# EAGLE schematic Domino Qi (EAGLE 6.5.0)
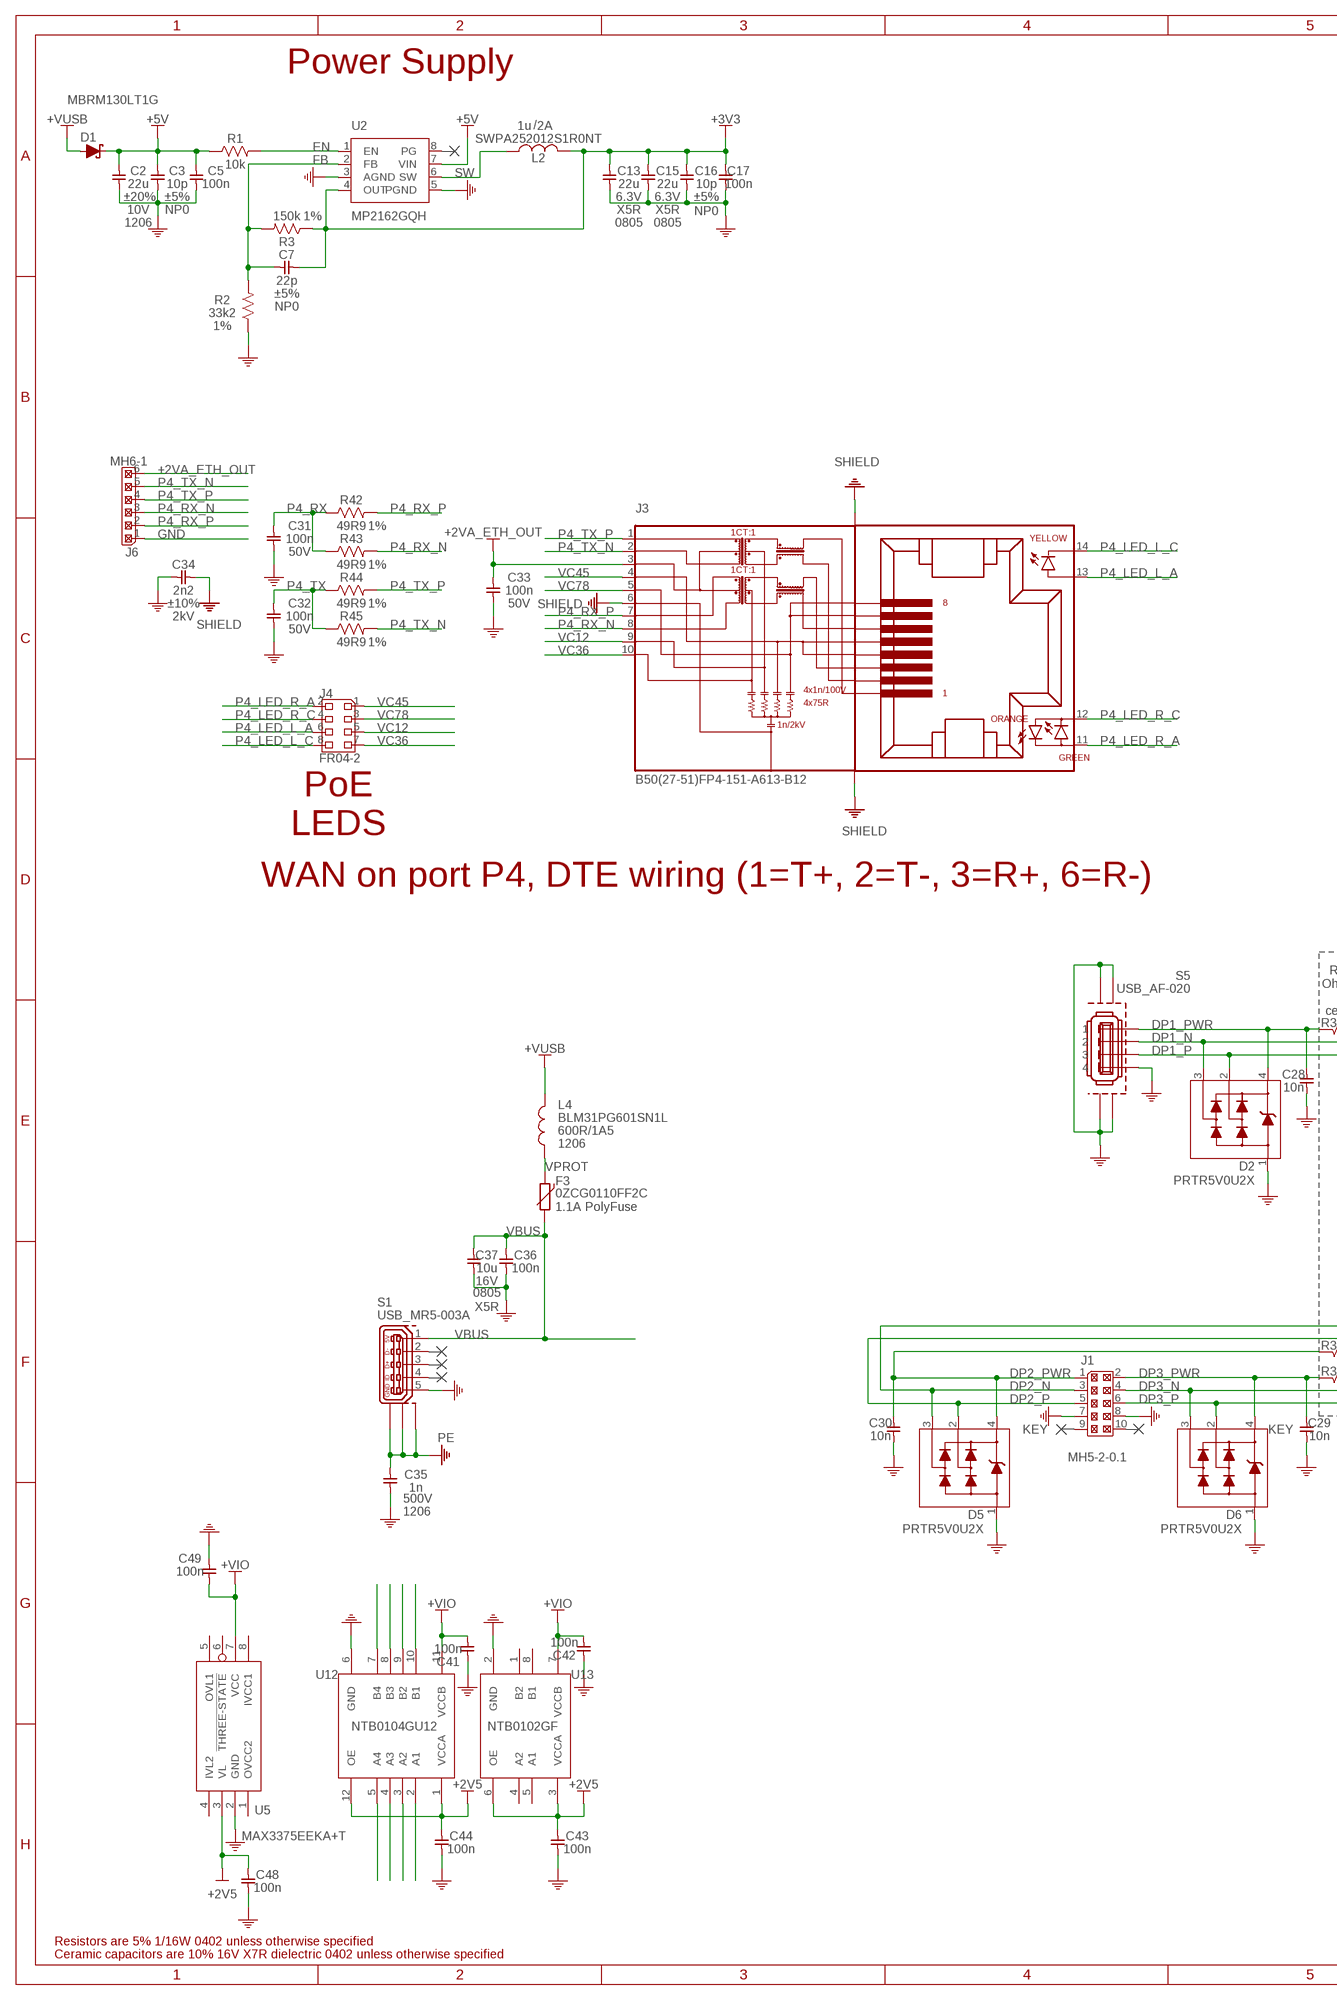
[diagram p0: schematic, sheet 1, part 1 of 2]
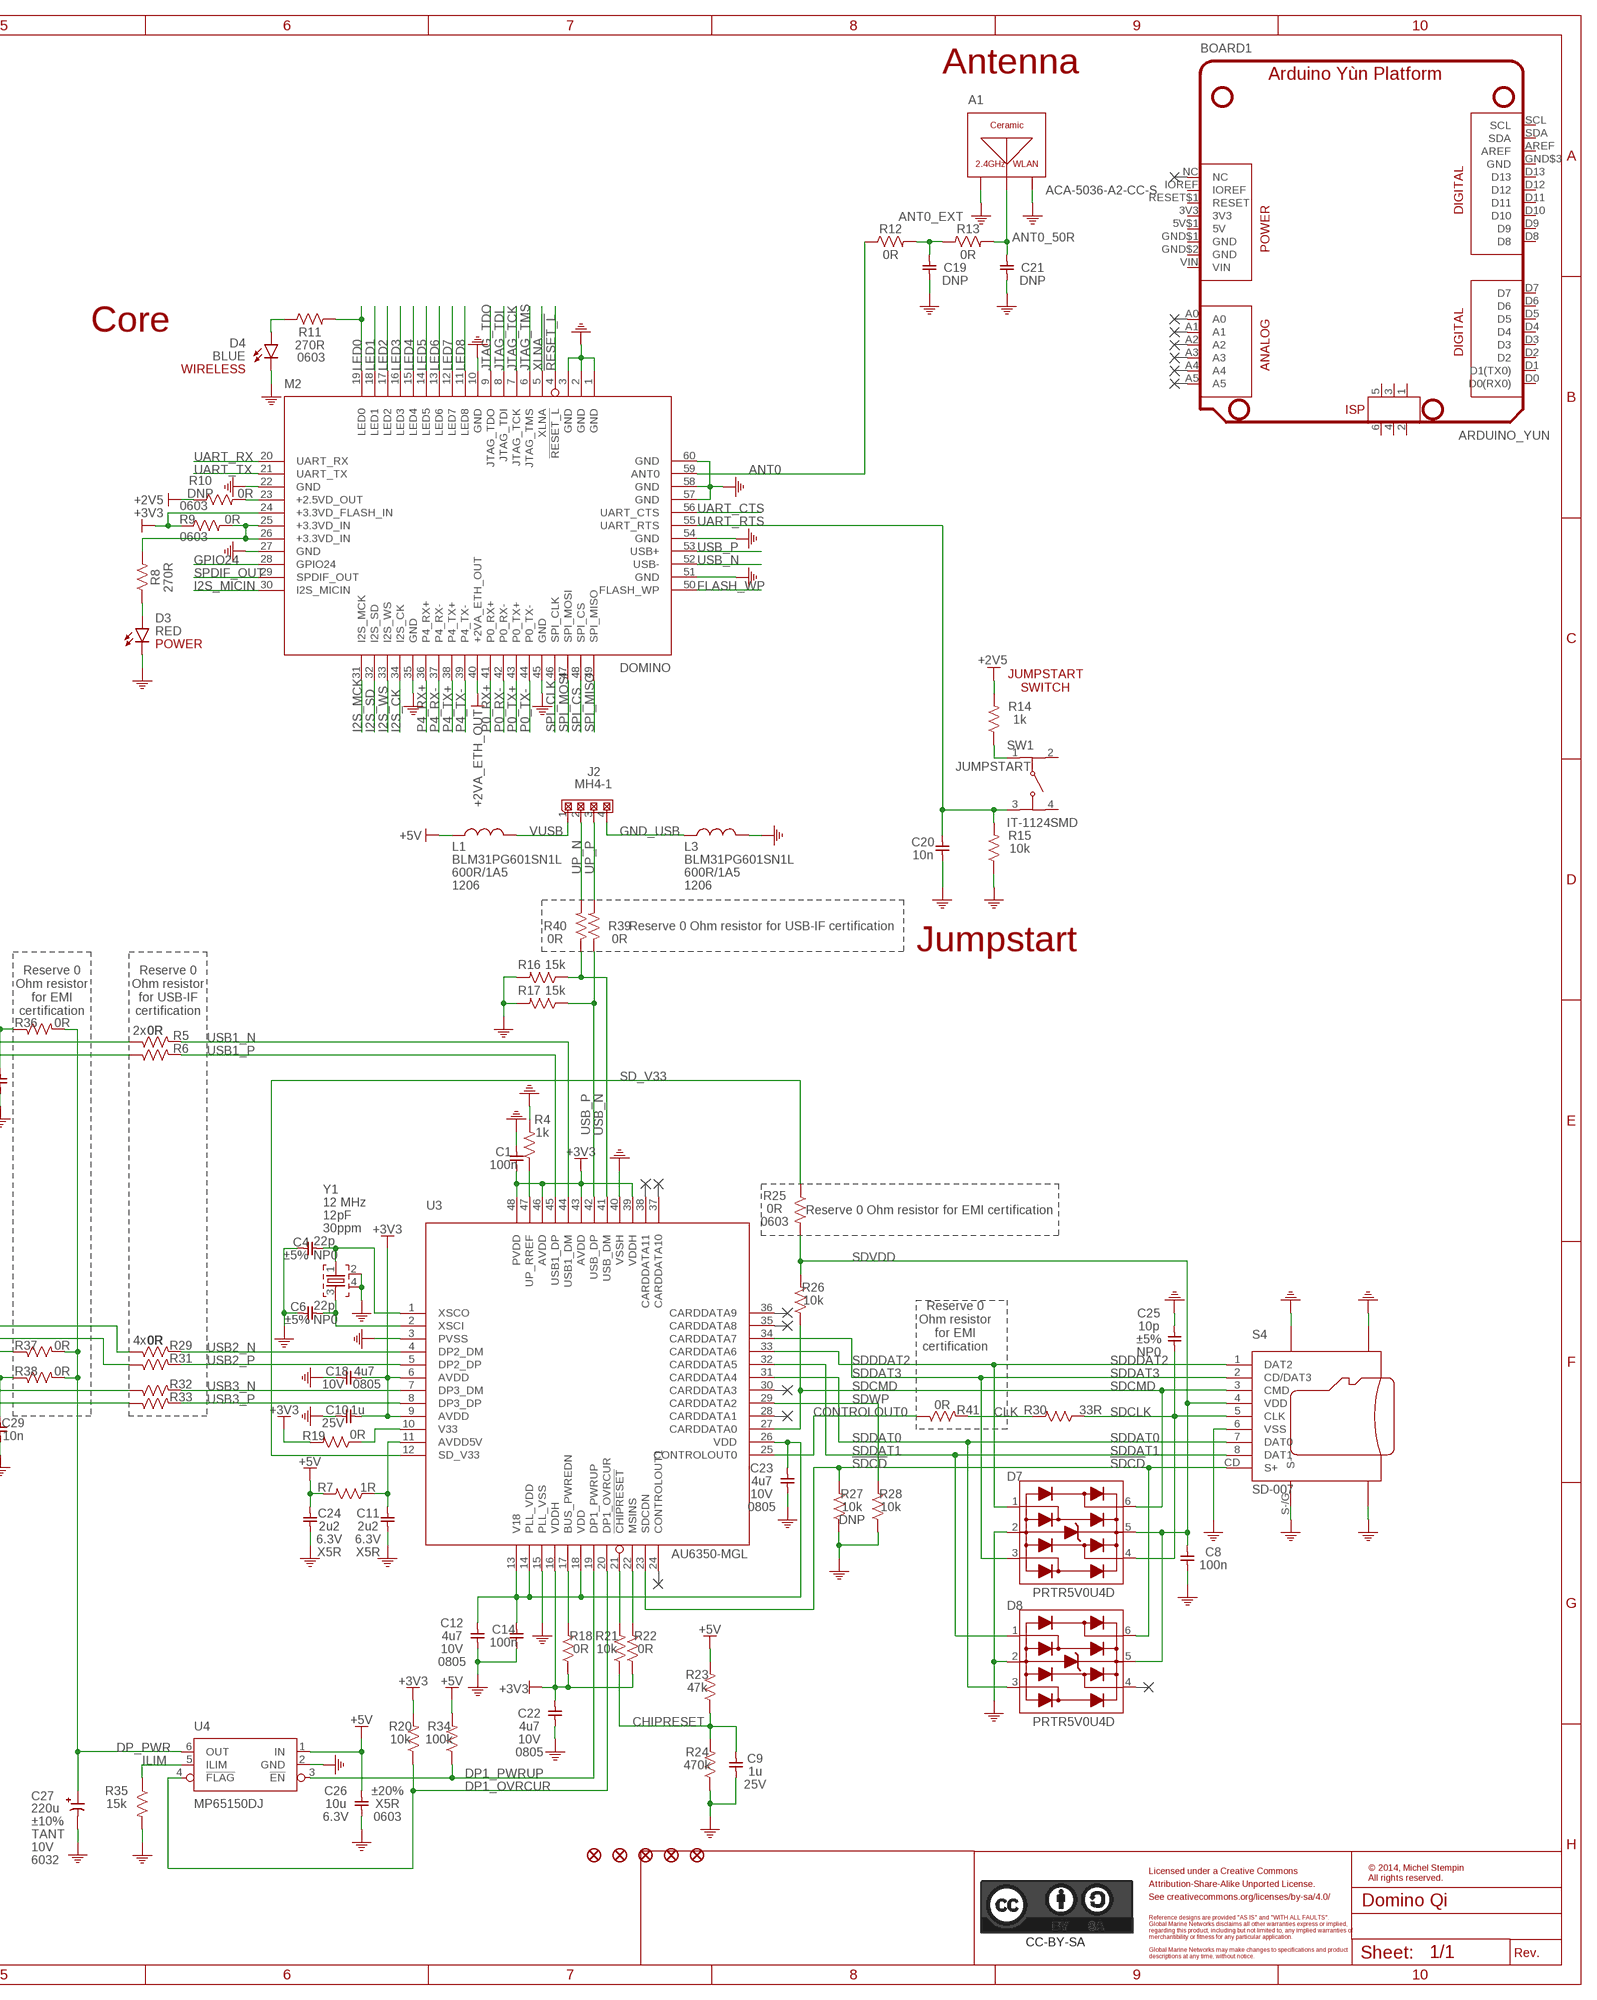
[diagram p1: schematic, sheet 1, part 2 of 2]
PORT1 (NC): BOM: EXCLUDE
PORT2 (NC): BOM: EXCLUDE
PORT3 (NC): BOM: EXCLUDE
PORT4 (NC): BOM: EXCLUDE
PORT5 (NC): BOM: EXCLUDE
PORT6 (NC): BOM: EXCLUDE
PORT7 (NC): BOM: EXCLUDE
PORT8 (NC): BOM: EXCLUDE
PORT9 (NC): BOM: EXCLUDE
PORT10 (NC): BOM: EXCLUDE
PORT11 (NC): BOM: EXCLUDE
PORT12 (NC): BOM: EXCLUDE
PORT13 (NC): BOM: EXCLUDE
PORT14 (NC): BOM: EXCLUDE
PORT15 (NC): BOM: EXCLUDE
PORT16 (NC): BOM: EXCLUDE
PORT17 (NC): BOM: EXCLUDE
PORT18 (NC): BOM: EXCLUDE
PORT19 (NC): BOM: EXCLUDE
PORT20 (NC): BOM: EXCLUDE
PORT21 (NC): BOM: EXCLUDE

## Parts
A1  ACA-5036-A2-CC-S  [ACA-5036-A2-CC-S]
BOARD1  ARDUINO_YUN  [ARDUINO-YUN-PLATFORM]
C1  100n  CAP_0402  [C0402]
C2  22u  CAP_1206  [C1206]
C3  10p  CAP_0402  [C0402]
C4  22p  CAP_0402  [C0402]
C5  100n  CAP_0402  [C0402]
C6  22p  CAP_0402  [C0402]
C7  22p  CAP_0402  [C0402]
C8  100n  CAP_0402  [C0402]
C9  1u  CAP_0402  [C0402]
C10  1u  CAP_0402  [C0402]
C11  2u2  CAP_0402  [C0402]
C12  4u7  CAP_0805  [C0805]
C13  22u  CAP_0805  [C0805]
C14  100n  CAP_0402  [C0402]
C15  22u  CAP_0805  [C0805]
C16  10p  CAP_0402  [C0402]
C17  100n  CAP_0402  [C0402]
C18  4u7  CAP_0805  [C0805]
C19  DNP  CAP_0402  [C0402]
C20  10n  CAP_0402  [C0402]
C21  DNP  CAP_0402  [C0402]
C22  4u7  CAP_0805  [C0805]
C23  4u7  CAP_0805  [C0805]
C24  2u2  CAP_0402  [C0402]
C25  10p  CAP_0402  [C0402]
C26  10u  CAP_0603  [C0603]
C27  220u  CPOL_C/6032-25  [C/6032-25]
C28  10n  CAP_0402  [C0402]
C29  10n  CAP_0402  [C0402]
C30  10n  CAP_0402  [C0402]
C31  100n  CAP_0402  [C0402]
C32  100n  CAP_0402  [C0402]
C33  100n  CAP_0402  [C0402]
C34  2n2  CAP_1206  [C1206]
C35  1n  CAP_1206  [C1206]
C36  100n  CAP_0402  [C0402]
C37  10u  CAP_0805  [C0805]
C41  100n  CAP_0402  [C0402]
C42  100n  CAP_0402  [C0402]
C43  100n  CAP_0402  [C0402]
C44  100n  CAP_0402  [C0402]
C48  100n  CAP_0402  [C0402]
C49  100n  CAP_0402  [C0402]
D1  MBRM130LT1G  [DO-216AA]
D2  PRTR5V0U2X  [SOT143B]
D3  RED  LED_0603  [LED0603]
D4  BLUE  LED_0603  [LED0603]
D5  PRTR5V0U2X  [SOT143B]
D6  PRTR5V0U2X  [SOT143B]
D7  PRTR5V0U4D  [SOT23-6]
D8  PRTR5V0U4D  [SOT23-6]
F1  FIDUCIAL  [FIDUCIAL]
F2  FIDUCIAL  [FIDUCIAL]
F3  0ZCG0110FF2C  [PTC1812]
F4  FIDUCIAL  [FIDUCIAL]
F5  FIDUCIAL  [FIDUCIAL]
F6  FIDUCIAL  [FIDUCIAL]
J1  MH5-2-0.1  MH5-2  [MH05-2-0.1]
J2  MH4-1  [MH4-1-0.1]
J3  B50(27-51)FP4-151-A613-B12  [B50(27-51)FP4-151-A613-B12]
J4  FR04-2  [FR04-2-0.1]
J6  MH6-1  [MH6-1-0.1]
L1  BLM31PG601SN1L  FB_1206  [FB1206]
L2  SWPA252012S1R0NT  [SWPA252012S]
L3  BLM31PG601SN1L  FB_1206  [FB1206]
L4  BLM31PG601SN1L  FB_1206  [FB1206]
M2  DOMINO  [DOMINO]
R1  10k  RES_0402  [R0402]
R2  33k2  RES_0402  [R0402]
R3  150k  RES_0402  [R0402]
R4  1k  RES_0402  [R0402]
R5  0R  RES_0402  [R0402]
R6  0R  RES_0402  [R0402]
R7  1R  RES_0402  [R0402]
R8  270R  RES_0402  [R0402]
R9  0R  RES_0603  [R0603]
R10  0R  RES_0603  [R0603]
R11  270R  RES_0603  [R0603]
R12  0R  RES_0402  [R0402]
R13  0R  RES_0402  [R0402]
R14  1k  RES_0402  [R0402]
R15  10k  RES_0402  [R0402]
R16  15k  RES_0402  [R0402]
R17  15k  RES_0402  [R0402]
R18  0R  RES_0402  [R0402]
R19  0R  RES_0402  [R0402]
R20  10k  RES_0402  [R0402]
R21  10k  RES_0402  [R0402]
R22  0R  RES_0402  [R0402]
R23  47k  RES_0402  [R0402]
R24  470k  RES_0402  [R0402]
R25  0R  RES_0603  [R0603]
R26  10k  RES_0402  [R0402]
R27  10k  RES_0402  [R0402]
R28  10k  RES_0402  [R0402]
R29  0R  RES_0402  [R0402]
R30  33R  RES_0402  [R0402]
R31  0R  RES_0402  [R0402]
R32  0R  RES_0402  [R0402]
R33  0R  RES_0402  [R0402]
R34  100k  RES_0402  [R0402]
R35  15k  RES_0402  [R0402]
R36  0R  RES_0402  [R0402]
R37  0R  RES_0402  [R0402]
R38  0R  RES_0402  [R0402]
R39  0R  RES_0402  [R0402]
R40  0R  RES_0402  [R0402]
R41  0R  RES_0402  [R0402]
R42  49R9  RES_0402  [R0402]
R43  49R9  RES_0402  [R0402]
R44  49R9  RES_0402  [R0402]
R45  49R9  RES_0402  [R0402]
S1  USB_MR5-003A  [USB_MR5-003A]
S4  SD-007  MICRO-SD  [SD-007]
S5  USB_AF-020  [USB_AF-020]
SW1  IT-1124SMD  [IT-1124SMD]
U2  MP2162GQH  [QFN-8_2X1.5]
U3  AU6350-MGL  [LQFP-48_7X7]
U4  MP65150DJ  [SOT23-6]
U5  MAX3375EEKA+T  [SOT23-8]
U12  NTB0104GU12  [XQFN-12]
U13  NTB0102GF  [SOT1089]
U$2  CC-BY-SA_LOGO  [CC-BY-SA_LOGO]
Y1  12 MHz  CRYSTAL_2SH  [CRYSTAL_32X25]

## Nets
!CHIPRESET: R21.2 U3.21(!CHIPRESET)
!RESET_L: M2.4(!RESET_L)
!SDCD: D8.6(I/O4) R27.2 S4.CD(S+) U3.23(SDCDN)
+2.5VD_OUT: M2.23(+2.5VD_OUT) R10.2
+2V5: C43.2 C44.2 C48.2 R10.1 R14.2 U5.3(VL) U12.1(VCCA) U12.12(OE) U13.3(VCCA) U13.6(OE)
+2VA_ETH_OUT [Ethernet0]: C33.2 J3.3 J6.6 M2.40(+2VA_ETH_OUT)
+3.3VD_IN1: M2.25(+3.3VD_IN) M2.26(+3.3VD_IN) R8.2 R9.2
+3V3: C1.2 C7.2 C10.2 C13.1 C15.1 C16.1 C17.1 C18.2 C22.2 L2.2 M2.24(+3.3VD_FLASH_IN) R3.1 R9.1 R18.1 R19.2 R20.2 R22.1 U2.4(OUT) U3.6(AVDD) U3.9(AVDD) U3.16(VDDH) U3.39(VDDH) U3.43(AVDD) U3.46(AVDD) U3.48(PVDD)
+5V: C2.1 C3.1 C5.1 C24.1 C26.1 D1.1(C) L1.2 R1.1 R7.2 R23.2 R34.2 U2.7(VIN) U4.1(IN)
+VIO: C41.1 C42.1 C49.1 U5.7(VCC) U12.11(VCCB) U13.7(VCCB)
+VUSB: D1.2(A) L4.1
ANT0 [RF]: M2.59(ANT0) R12.1
ANT0_50R: A1.FEED(A) C21.1 R13.2
ANT0_EXT [RF]: C19.1 R12.2 R13.1
AVDD5V1: C11.1 R7.1 U3.11(AVDD5V)
BLUE_LED: D4.2(A) R11.1
BUS_PWREDN: R18.2 U3.17(BUS_PWREDN)
CHIPRESET: C9.1 R21.1 R23.1 R24.2
CLK: R30.2 R41.2
CONTROLOUT0: R41.1 U3.25(CONTROLOUT0)
DP1_N [USB]: D2.3 R5.1 S5.2
DP1_OVRCUR: R20.1 U3.20(DP1_OVRCUR) U4.4(!FLAG)
DP1_P [USB]: D2.2 R6.1 S5.3
DP1_PWR: C28.1 D2.4 R36.1 S5.1
DP1_PWRUP: R34.1 U3.19(DP1_PWRUP) U4.3(!EN)
DP2_N [USB]: D5.3 J1.3 R29.1
DP2_P [USB]: D5.2 J1.5 R31.1
DP2_PWR: C30.1 D5.4 J1.1 R37.1
DP3_N [USB]: D6.3 J1.4 R32.1
DP3_P [USB]: D6.2 J1.6 R33.1
DP3_PWR: C29.1 D6.4 J1.2 R38.1
DP_PWR: C27.1(+) R36.2 R37.2 R38.2 U4.6(OUT)
EN: R1.2 U2.1(EN)
FB: C7.1 R2.2 R3.2 U2.2(FB)
FLASH_WP: M2.50(FLASH_WP)
GND: A1.GND$1(GND) A1.GND$2(GND) C1.1 C2.2 C3.2 C4.1 C5.2 C6.1 C8.2 C9.2 C10.1 C11.2 C12.1 C13.2 C14.2 C15.2 C16.2 C17.2 C18.1 C19.2 C20.2 C21.2 C22.1 C23.1 C24.2 C25.2 C26.2 C27.2(-) C28.2 C29.2 C30.2 C31.1 C32.1 C33.1 C34.1 C35.2 C36.2 C37.2 C41.2 C42.2 C43.1 C44.1 C48.1 C49.2 D2.1 D3.1(C) D4.1(C) D5.1 D6.1 D7.2(GND) D8.2(GND) J1.7 J1.8 J6.1 L3.1 M2.1(GND) M2.2(GND) M2.3(GND) M2.10(GND) M2.22(GND) M2.27(GND) M2.35(GND) M2.45(GND) M2.51(GND) M2.54(GND) M2.57(GND) M2.58(GND) M2.60(GND) R2.1 R4.2 R15.1 R16.2 R17.2 R24.1 R27.1 R28.1 R35.2 S1.5 S4.6(VSS) S4.G$1(G) S4.G$2(G) S4.G$3(G) S4.S-/G(S-) S5.4 S5.G$1(G) S5.G$2(G) S5.G$3(G) S5.G$4(G) U2.3(AGND) U2.5(PGND) U3.3(PVSS) U3.15(PLL_VSS) U3.40(VSSH) U4.2(GND) U5.2(GND) U12.6(GND) U13.2(GND) Y1.2 Y1.4
GND_USB: J2.4 L3.2
GPIO24: M2.28(GPIO24)
I2S_CK: M2.34(I2S_CK)
I2S_MCK: M2.31(I2S_MCK)
I2S_MICIN: M2.30(I2S_MICIN)
I2S_SD: M2.32(I2S_SD)
I2S_WS: M2.33(I2S_WS)
ILIM: R35.1 U4.5(ILIM)
JTAG_TCK: M2.7(JTAG_TCK)
JTAG_TDI: M2.8(JTAG_TDI)
JTAG_TDO: M2.9(JTAG_TDO)
JTAG_TMS: M2.6(JTAG_TMS)
JUMPSTART: R14.1 SW1.1
LED0: M2.19(LED0) R11.2
LED1: M2.18(LED1)
LED2: M2.17(LED2)
LED3: M2.16(LED3)
LED4: M2.15(LED4)
LED5: M2.14(LED5)
LED6: M2.13(LED6)
LED7: M2.12(LED7)
LED8: M2.11(LED8)
MSINS: R22.2 U3.22(MSINS)
N$1: D3.2(A) R8.1
N$2: U12.5(A4)
N$3: U12.4(A3)
N$4: U12.3(A2)
N$5: U12.2(A1)
N$6: U12.10(B1)
N$7: U12.9(B2)
N$8: U12.8(B3)
N$9: U12.7(B4)
P0_RX+ [Ethernet0]: M2.41(P0_RX+)
P0_RX- [Ethernet0]: M2.42(P0_RX-)
P0_TX+ [Ethernet0]: M2.43(P0_TX+)
P0_TX- [Ethernet0]: M2.44(P0_TX-)
P4_LED_L_A: J3.13 J4.6
P4_LED_L_C: J3.14 J4.8
P4_LED_R_A: J3.11 J4.2
P4_LED_R_C: J3.12 J4.4
P4_RX: C31.2 R42.1 R43.1
P4_RX+ [Ethernet0]: M2.36(P4_RX+)
P4_RX- [Ethernet0]: M2.37(P4_RX-)
P4_RX_N [USB]: J3.8 J6.3 R43.2
P4_RX_P [USB]: J3.7 J6.2 R42.2
P4_TX: C32.2 R44.1 R45.1
P4_TX+ [Ethernet0]: M2.38(P4_TX+)
P4_TX- [Ethernet0]: M2.39(P4_TX-)
P4_TX_N [USB]: J3.2 J6.5 R45.2
P4_TX_P [USB]: J3.1 J6.4 R44.2
PE: C35.1 S1.S$1(M0) S1.S$2(M1) S1.S$3(M2)
SD_V33: R25.1 U3.12(SD_V33)
SDCLK: C25.1 D7.4(I/O3) R30.1 S4.5(CLK)
SDCMD: D7.6(I/O4) R26.1 S4.3(CMD) U3.27(CARDDATA0)
SDDAT0: D8.3(I/O2) S4.7(DAT0) U3.31(CARDDATA4)
SDDAT1: D8.1(I/O1) S4.8(DAT1) U3.32(CARDDATA5)
SDDAT3: D7.3(I/O2) S4.2(CD/DAT3) U3.34(CARDDATA7)
SDDDAT2: D7.1(I/O1) S4.1(DAT2) U3.33(CARDDATA6)
SDVDD: C8.1 D7.5(VCC) D8.5(VCC) R25.2 R26.2 S4.4(VDD)
SDWP: R28.2 U3.29(CARDDATA2)
SHIELD: C34.2 J3.6 J3.SH$1(SHIELD) J3.SH$2(SHIELD)
SPDIF_OUT: M2.29(SPDIF_OUT)
SPI_CLK: M2.46(SPI_CLK)
SPI_CS: M2.48(SPI_CS)
SPI_MISO: M2.49(SPI_MISO)
SPI_MOSI: M2.47(SPI_MOSI)
SW: L2.1 U2.6(SW)
UART_CTS: M2.56(UART_CTS)
UART_RTS: C20.1 M2.55(UART_RTS) R15.2 SW1.3
UART_RX: M2.20(UART_RX)
UART_TX: M2.21(UART_TX)
UP_N [USB]: J2.2 R40.2
UP_P [USB]: J2.3 R39.2
UP_PREF: R4.1 U3.47(UP_RREF)
USB1_N [USB]: R5.2 U3.44(USB1_DM)
USB1_P [USB]: R6.2 U3.45(USB1_DP)
USB2_N [USB]: R29.2 U3.4(DP2_DM)
USB2_P [USB]: R31.2 U3.5(DP2_DP)
USB3_N [USB]: R32.2 U3.7(DP3_DM)
USB3_P [USB]: R33.2 U3.8(DP3_DP)
USB_N [USB]: M2.52(USB-) R16.1 R40.1 U3.41(USB_DM)
USB_P [USB]: M2.53(USB+) R17.1 R39.1 U3.42(USB_DP)
V1: R19.1 U3.10(V33)
V18: C12.2 C14.1 C23.2 U3.13(V18) U3.14(PLL_VDD) U3.18(VDD) U3.26(VDD)
VBUS: C36.1 C37.1 F3.2 S1.1
VC12 [RF]: J3.9 J4.5
VC36 [RF]: J3.10 J4.7
VC45 [RF]: J3.4 J4.1
VC78 [RF]: J3.5 J4.3
VPROT: F3.1 L4.2
VUSB: J2.1 L1.1
XLNA: M2.5(XLNA)
XSCI: C6.2 U3.2(XSCI) Y1.3
XSCO: C4.2 U3.1(XSCO) Y1.1
Unconnected: BOARD1.1(MISO) BOARD1.3(SCK) BOARD1.3V3 BOARD1.4(MOSI) BOARD1.5(RESET) BOARD1.A0 BOARD1.A1 BOARD1.A2 BOARD1.A3 BOARD1.A4 BOARD1.A5 BOARD1.AREF BOARD1.D0(D0(RX0)) BOARD1.D1(D1(TX0)) BOARD1.D2 BOARD1.D3 BOARD1.D4 BOARD1.D5 BOARD1.D6 BOARD1.D7 BOARD1.D8 BOARD1.D9 BOARD1.D10 BOARD1.D11 BOARD1.D12 BOARD1.D13 BOARD1.GND$1(GND) BOARD1.GND$2(GND) BOARD1.NC BOARD1.RESET$1(RESET) BOARD1.SCL BOARD1.SDA D8.4(I/O3) J1.9 J1.10 S1.2 S1.3 S1.4 SW1.2 SW1.4 U2.8(PG) U3.24(CONTROLOUT1) U3.28(CARDDATA1) U3.30(CARDDATA3) U3.35(CARDDATA8) U3.36(CARDDATA9) U3.37(CARDDATA10) U3.38(CARDDATA11) U5.1(OVCC2) U5.4(IVL2) U5.5(OVL1) U5.6(!THREE-STATE) U5.8(IVCC1) U13.1(B2) U13.4(A2) U13.5(A1) U13.8(B1)

## Notes on the sheet
- Power Supply | Antenna
- /
- Core
- WIRELESS
- POWER
- JUMPSTART
  SWITCH
- PoE
- LEDS
- WAN on port P4, DTE wiring (1=T+, 2=T-, 3=R+, 6=R-)
- Reserve 0 Ohm resistor for USB-IF certification
- Jumpstart
- Reserve 0
  Ohm resistor
  for EMI
  certification
- Reserve 0
  Ohm resistor
  for USB-IF
  certification
- 2x
- PolyFuse | Reserve 0 Ohm resistor for EMI certification
- Reserve 0
  Ohm resistor
  for EMI
  certification
- 4x
- KEY | KEY
- Licensed under a Creative Commons
- © 2014, Michel Stempin
  All rights reserved.
- Attribution-Share-Alike Unported License.
- See creativecommons.org/licenses/by-sa/4.0/
- Reference designs are provided "AS IS" and "WITH ALL FAULTS".
- Global Marine Networks disclaims all other warranties express or implied,
- regarding this product, including but not limited to, any implied warranties of
- merchantibility or fitness for any particular application.
- Resistors are 5% 1/16W 0402 unless otherwise specified
- Global Marine Networks may make changes to specifications and product
- Ceramic capacitors are 10% 16V X7R dielectric 0402 unless otherwise specified | descriptions at any time, without notice. | Rev.

## Power pins joined to a net without a drawn wire
5V: BOARD1.2(5V) BOARD1.5V$1(5V)
GND: BOARD1.6(GND) BOARD1.GND$3(GND)
IOREF: BOARD1.IOREF
VIN: BOARD1.VIN

## Library data of the parts
A1 = Domino:ACA-5036-A2-CC-S: 2.4GHz ISM Band Chip Antenna; PARTNO: ACA-5036-A2-CC-S
BOARD1 = Domino:ARDUINO_YUN: Arduino Yùn Platform
C1 C5 C8 C14 C17 C31-C33 C36 C41-C44 C48 C49 = Domino:CAP_: Capacitor; PARTNO: C0402_100n_X7R_10%_CER_50V; SIZE: 0402; TC: X7R; TOL: ±10%; TYPE: CER; VOLT: 50V
C2 = Domino:CAP_: Capacitor; PARTNO: C1206_22u_X7R_20%_CER_10V; SIZE: 1206; TC: X7R; TOL: ±20%; TYPE: CER; VOLT: 10V
C3 C16 C25 = Domino:CAP_: Capacitor; PARTNO: C0402_10p_NP0_5%_CER_50V; SIZE: 0402; TC: NP0; TOL: ±5%; TYPE: CER; VOLT: 50V
C4 C6 C7 = Domino:CAP_: Capacitor; PARTNO: C0402_22p_NP0_5%_CER_50V; SIZE: 0402; TC: NP0; TOL: ±5%; TYPE: CER; VOLT: 50V
C9 C10 = Domino:CAP_: Capacitor; PARTNO: C0402_1u_X7R_10%_CER_25V; SIZE: 0402; TC: X7R; TOL: ±10%; TYPE: CER; VOLT: 25V
C11 C24 = Domino:CAP_: Capacitor; PARTNO: C0402_2u2_X5R_10%_CER_6V3; SIZE: 0402; TC: X5R; TOL: ±10%; TYPE: CER; VOLT: 6.3V
C12 C18 C22 C23 = Domino:CAP_: Capacitor; PARTNO: C0805_4u7_X7R_10%_CER_6V3; SIZE: 0805; TC: X7R; TOL: 10%; TYPE: CER; VOLT: 10V
C13 C15 = Domino:CAP_: Capacitor; PARTNO: C0805_22u_X5R_20%_CER_6V3; SIZE: 0805; TC: X5R; TOL: ±20%; TYPE: CER; VOLT: 6.3V
C19 C21 = Domino:CAP_: Capacitor; DNP: T; PARTNO: C0402_DNP; SIZE: 0402
C20 C28-C30 = Domino:CAP_: Capacitor; PARTNO: C0402_10n_X7R_10%_CER_50V; SIZE: 0402; TC: X7R; TOL: ±10%; TYPE: CER; VOLT: 50V
C26 = Domino:CAP_: Capacitor; PARTNO: C0603_10u_X5R_20%_CER_6V3; SIZE: 0603; TC: X5R; TOL: ±20%; TYPE: CER; VOLT: 6.3V
C27 = Domino:CPOL_?*: Polarized Capacitor; PARTNO: CPOLC-6032_220u_20%_TANT_10V; SIZE: 6032; TOL: ±10%; TYPE: TANT; VOLT: 10V
C34 = Domino:CAP_: Capacitor; PARTNO: C1210_2n2_X7R_10%_CER_2kV; SIZE: 1206; TC: X7R; TOL: ±10%; TYPE: CER; VOLT: 2kV
C35 = Domino:CAP_: Capacitor; PARTNO: C1206_1n_X7R_10%_CER_500V; SIZE: 1206; TC: X7R; TOL: ±10%; TYPE: CER; VOLT: 500V
C37 = Domino:CAP_: Capacitor; PARTNO: C0805_10u_X5R_10%_CER_16V; SIZE: 0805; TC: X5R; TOL: ±10%; TYPE: CER; VOLT: 16V
D1 = Domino:MBRM130: Schottky Barrier Rectifier, 1A, 30V; PARTNO: MBRM130LT1G; RATE: 1A; VOLT: 30V
D2 D5 D6 = Domino:PRTR5V0U2X: Ultra low capacitance double rail-to-rail ESD protection diode; PARTNO: PRTR5V0U2X
D3 = Domino:LED_: LED; PARTNO: LED0603-RED
D4 = Domino:LED_: LED; PARTNO: LED0603-BLUE
D7 D8 = Domino:PRTR5V0U4D: Ultra low capacitance quadruple rail-to-rail ESD protection; PARTNO: PRTR5V0U4D
F1 F2 F4-F6 = Domino:FIDUCIAL: Fiducial Mark Copyright © 2012, Michel Stempin, All rights reserved Licenced under Creative Commons CC BY-SA 3.0 <http://creativecommons.org/licenses/by-sa/3.0/deed.en> license.; BOM: EXCLUDE
F3 = Domino:0ZCG: Bel 0ZCG Series Surface Mount PTC; PARTNO: 0ZCG0110FF2C; RATE: 1.1A; VOLT: 8V
J1 = Domino:MH5-2: 2x5 Pin Male Header; PARTNO: MH5-2-0.1
J2 = Domino:MH4-1: 4x1 Pin Male Header; PARTNO: MH4-1-0.1
J3 = Domino:B50(27-51)FP4-151-A613-B12: Single Port RJ45 100Base-T with PoE, Transformer, 1 Magnetic Ring, 15 Pins, 3 LEDs (Left Orange/Green, Right Yellow) Without Shielding Shell Shrapnel, 3µ Gold, Pin Back, PA66 material, No Logo; PARTNO: B50(27-51)FP4-151-A613-B12
J4 = Domino:FR04-2: 2x4 Pin Female Receptacle; PARTNO: FR04-2-0.1
J6 = Domino:MH6-1: 6x1 Pin Male Header; PARTNO: MH6-1-0.1
L1 L3 L4 = Domino:FB_: Ferrite Bead; OPT: 600R/1A5; PARTNO: BLM31PG601SN1L; SIZE: 1206
L2 = Domino:SWPA252012S*?: 2.0 x 1.5 mm Footprint 1.2mm Height Shielded Inductor; INDUCTANCE: 1u; PARTNO: SWPA252012SMT; RATE: 2A; TOL: ±30%
M2 = Domino:DOMINO: GL-Connect Domino WiFi Module; PARTNO: DOMINO-CORE
R1 R15 R20 R21 R26 R28 = Domino:RES_: Resistor; PARTNO: R0402_10k_5%_62.5mW; RATE: 62.5mW; SIZE: 0402; TOL: 5%
R2 = Domino:RES_: Resistor; PARTNO: R0402_33k2_1%_62.5mW; RATE: 62.5mW; SIZE: 0402; TOL: 1%
R3 = Domino:RES_: Resistor; PARTNO: R0402_150k_1%_62.5mW; RATE: 62.5mW; SIZE: 0402; TOL: 1%
R4 R14 = Domino:RES_: Resistor; PARTNO: R0402_1k_5%_62.5mW; RATE: 62.5mW; SIZE: 0402; TOL: 5%
R5 R6 R12 R13 R18 R22 R29 R31-R33 R36-R41 = Domino:RES_: Resistor; PARTNO: R0402_0R_5%_62.5mW; RATE: 62.5mW; SIZE: 0402; TOL: 5%
R7 = Domino:RES_: Resistor; PARTNO: R0402_1R_5%_62.5mW; RATE: 62.5mW; SIZE: 0402; TOL: 5%
R8 = Domino:RES_: Resistor; PARTNO: R0402_270R_5%_62.5mW; RATE: 62.5mW; SIZE: 0402; TOL: 5%
R9 R25 = Domino:RES_: Resistor; PARTNO: R0603_0R_5%_125mW; RATE: 125mW; SIZE: 0603; TOL: 5%
R10 = Domino:RES_: Resistor; DNP: T; PARTNO: R0603_0R_5%_125mW; RATE: 125mW; SIZE: 0603; TOL: 5%
R11 = Domino:RES_: Resistor; PARTNO: R0603_270R_5%_125mW; RATE: 125mW; SIZE: 0603; TOL: 5%
R16 R17 R35 = Domino:RES_: Resistor; PARTNO: R0402_15k_5%_62.5mW; RATE: 62.5mW; SIZE: 0402; TOL: 5%
R19 = Domino:RES_: Resistor; PARTNO: R0402_0R_5%_62.5mW; RATE: 125mW; SIZE: 0402; TOL: 5%
R23 = Domino:RES_: Resistor; PARTNO: R0402_47k_5%_62.5mW; RATE: 62.5mW; SIZE: 0402; TOL: 5%
R24 = Domino:RES_: Resistor; PARTNO: R0402_470k_5%_62.5mW; RATE: 62.5mW; SIZE: 0402; TOL: 5%
R27 = Domino:RES_: Resistor; DNP: T; PARTNO: R0402_10k_5%_62.5mW; RATE: 62.5mW; SIZE: 0402; TOL: 5%
R30 = Domino:RES_: Resistor; PARTNO: R0402_33R_5%_62.5mW; RATE: 62.5mW; SIZE: 0402; TOL: 5%
R34 = Domino:RES_: Resistor; PARTNO: R0402_100k_5%_62.5mW; RATE: 62.5mW; SIZE: 0402; TOL: 5%
R42-R45 = Domino:RES_: Resistor; PARTNO: R0402_49R9_1%_62.5mW; RATE: 62.5mW; SIZE: 0402; TOL: 1%
S1 = Domino:USB_MR5-003: Micro USB Type B Receptacle, 3 Shield Pins; PARTNO: USB MR5-003A
S4 = Domino:MICRO-SD: Micro SD Memory Card Connector, With Card Detect Switch; PARTNO: SD-007
S5 = Domino:USB_AF-020: USB Type A Socket; PARTNO: USB_AF-020
SW1 = Domino:IT-1124SMD: SPST Tact Switch; PARTNO: IT-1124SMD
U2 = Domino:MP2162: 2A, 6V, 1.5MHz Synchronous Step-Down Switcher; PARTNO: MP2162GQH
U3 = Domino:AU6350-MGL: USB2.0 Hub-Reader Controller; PARTNO: AU6350-MGL
U4 = Domino:MP65150DJ: Precision 60mA-1.7A Programmable Current-Limited Power Distribution Switch; PARTNO: MP65150DJ
U5 = Domino:MAX3375E: Dual Low-Voltage Level Translators; PARTNO: MAX3375EEKA+T
U12 = Domino:NTB0104: Dual supply translating transceiver; auto direction sensing; 3-state; PARTNO: NTB0104GU12
U13 = Domino:NTB0102: Dual supply translating transceiver; auto direction sensing; 3-state; PARTNO: NTB0102GF
U$2 = Domino:CC-BY-SA_LOGO: Attribution-Share-Alike Unported License See creativecommons.org/licenses/by-sa/3.0/ for details.; BOM: EXCLUDE
Y1 = Domino:CRYSTAL_2SH: Crystal with 2 Shield Pins; LOAD: 12pF; PARTNO: CRYSTAL_32X25_2SH_12PF_30PPM; TOL: 30ppm

## Net classes
1 USB: width 0.368 mm, clearance 0.152 mm to class 0, clearance 0.152 mm
2 RF: width 0.66 mm, clearance 0.152 mm
3 Ethernet0: width 0.254 mm, clearance 0.152 mm to class 0, clearance 0.152 mm to class 1, clearance 0.152 mm to class 2, clearance 0.152 mm